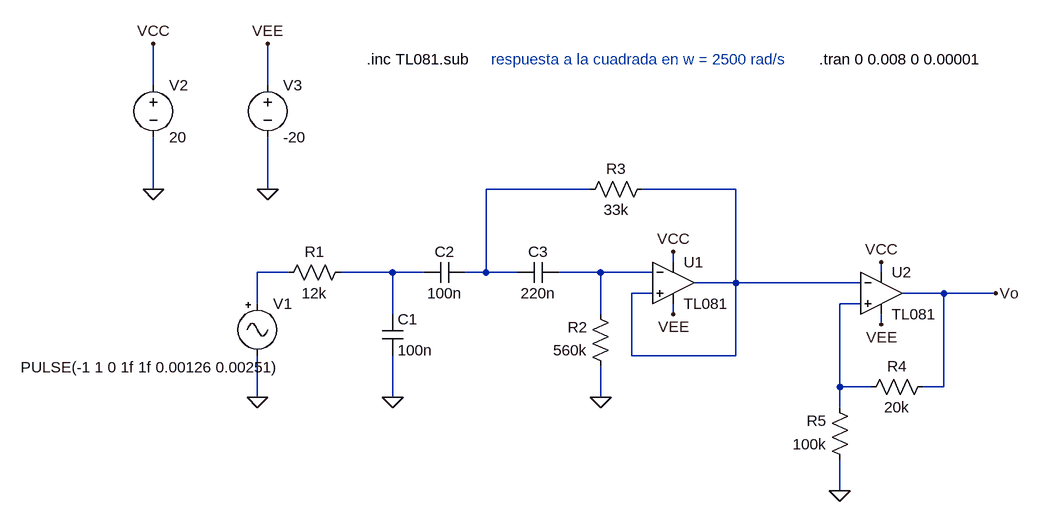
[diagram p0: schematic rtaCuad3.asc]
rtaCuad3.asc, the LTspice schematic file:
Version 4
SHEET 1 1176 704
WIRE -400 64 -400 0
WIRE -224 64 -224 0
WIRE -400 224 -400 144
WIRE -224 224 -224 144
WIRE 272 224 112 224
WIRE 496 224 352 224
WIRE 400 336 400 320
WIRE -192 352 -240 352
WIRE -32 352 -112 352
WIRE 16 352 -32 352
WIRE 112 352 112 224
WIRE 112 352 80 352
WIRE 160 352 112 352
WIRE 288 352 224 352
WIRE 368 352 288 352
WIRE 720 352 720 336
WIRE 496 368 496 224
WIRE 496 368 432 368
WIRE 688 368 496 368
WIRE 368 384 336 384
WIRE 816 384 752 384
WIRE 896 384 816 384
WIRE -240 400 -240 352
WIRE 688 400 656 400
WIRE -32 416 -32 352
WIRE 288 416 288 352
WIRE 400 416 400 400
WIRE 720 432 720 416
WIRE 336 480 336 384
WIRE 496 480 496 368
WIRE 496 480 336 480
WIRE 656 528 656 400
WIRE 704 528 656 528
WIRE 816 528 816 384
WIRE 816 528 784 528
WIRE -240 544 -240 480
WIRE -32 544 -32 480
WIRE 288 544 288 496
WIRE 656 560 656 528
WIRE 656 688 656 640
FLAG -240 544 0
FLAG -400 224 0
FLAG -400 0 VCC
FLAG -224 224 0
FLAG -224 0 VEE
FLAG -32 544 0
FLAG 288 544 0
FLAG 400 320 VCC
FLAG 400 416 VEE
FLAG 720 336 VCC
FLAG 720 432 VEE
FLAG 656 688 0
FLAG 896 384 Vo
SYMBOL Voltage -400 48 R0
SYMATTR InstName V2
SYMATTR Value 20
SYMBOL Voltage -224 48 R0
SYMATTR InstName V3
SYMATTR Value -20
SYMBOL Misc/signal -240 384 R0
WINDOW 3 -364 114 Left 2
SYMATTR Value PULSE(-1 1 0 1f 1f 0.00126 0.00251)
SYMATTR InstName V1
SYMBOL Cap -48 416 R0
SYMATTR InstName C1
SYMATTR Value 100n
SYMATTR SpiceLine IC=0
SYMBOL Cap 80 336 R90
WINDOW 0 0 32 VBottom 2
WINDOW 3 32 32 VTop 2
SYMATTR InstName C2
SYMATTR Value 100n
SYMATTR SpiceLine IC=0
SYMBOL Cap 224 336 R90
WINDOW 0 0 32 VBottom 2
WINDOW 3 32 32 VTop 2
SYMATTR InstName C3
SYMATTR Value 220n
SYMATTR SpiceLine IC=0
SYMBOL Res -96 336 R90
WINDOW 0 0 56 VBottom 2
WINDOW 3 32 56 VTop 2
SYMATTR InstName R1
SYMATTR Value 12k
SYMBOL Res 304 512 R180
WINDOW 0 36 76 Left 2
WINDOW 3 36 40 Left 2
SYMATTR InstName R2
SYMATTR Value 560k
SYMBOL Res 256 240 R270
WINDOW 0 32 56 VTop 2
WINDOW 3 0 56 VBottom 2
SYMATTR InstName R3
SYMATTR Value 33k
SYMBOL OpAmps/opamp2 400 304 R0
SYMATTR InstName U1
SYMATTR Value TL081
SYMBOL OpAmps/opamp2 720 320 R0
SYMATTR InstName U2
SYMATTR Value TL081
SYMBOL Res 800 512 R90
WINDOW 0 0 56 VBottom 2
WINDOW 3 32 56 VTop 2
SYMATTR InstName R4
SYMATTR Value 20k
SYMBOL Res 672 656 R180
WINDOW 0 36 76 Left 2
WINDOW 3 36 40 Left 2
SYMATTR InstName R5
SYMATTR Value 100k
TEXT -72 24 Left 2 !.inc TL081.sub
TEXT 624 24 Left 2 !.tran 0 0.008 0 0.00001
TEXT 120 24 Left 2 ;respuesta a la cuadrada en w = 2500 rad/s

The netlist it stands for:
* rtaCuad3.asc
V2 VCC 0 20
V3 VEE 0 -20
V1 N003 0 PULSE(-1 1 0 1f 1f 0.00126 0.00251)
C1 N004 0 100n IC=0
C2 N001 N004 100n IC=0
C3 N005 N001 220n IC=0
R1 N004 N003 12k
R2 0 N005 560k
R3 N001 N002 33k
XU1 N002 N005 VCC VEE N002 TL081  ; pins In+ In- V+ V- OUT
XU2 N006 N002 VCC VEE Vo TL081  ; pins In+ In- V+ V- OUT
R4 Vo N006 20k
R5 0 N006 100k
.inc TL081.sub
.tran 0 0.008 0 0.00001
* respuesta a la cuadrada en w = 2500 rad/s
.backanno
.end